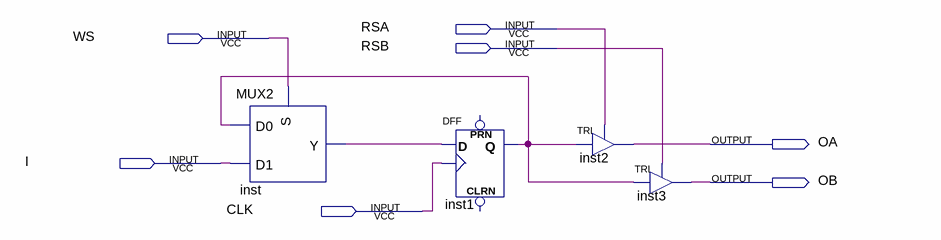
[diagram p0: schematic sheet]
// Quartus schematic RFC.bdf as structural Verilog: 4 symbols, 7 pins
module RFC (
  input  RSA,
  input  WS,
  input  RSB,
  input  I,
  input  CLK,
  output OA,
  output OB
);

  wire inst1_q, inst_y;

  MUX2 inst (.S(WS), .D1(I), .D0(inst1_q), .Y(inst_y));
  DFF inst1 (.CLK(CLK), .D(inst_y), .Q(inst1_q));  // open: CLRN, PRN
  TRI inst2 (.IN(inst1_q), .OE(RSA), .OUT(OA));
  TRI inst3 (.IN(inst1_q), .OE(RSB), .OUT(OB));
endmodule
